# Altium schematic sheet Sheet_1_2022-03-27.schdoc
size 391 x 229 mm
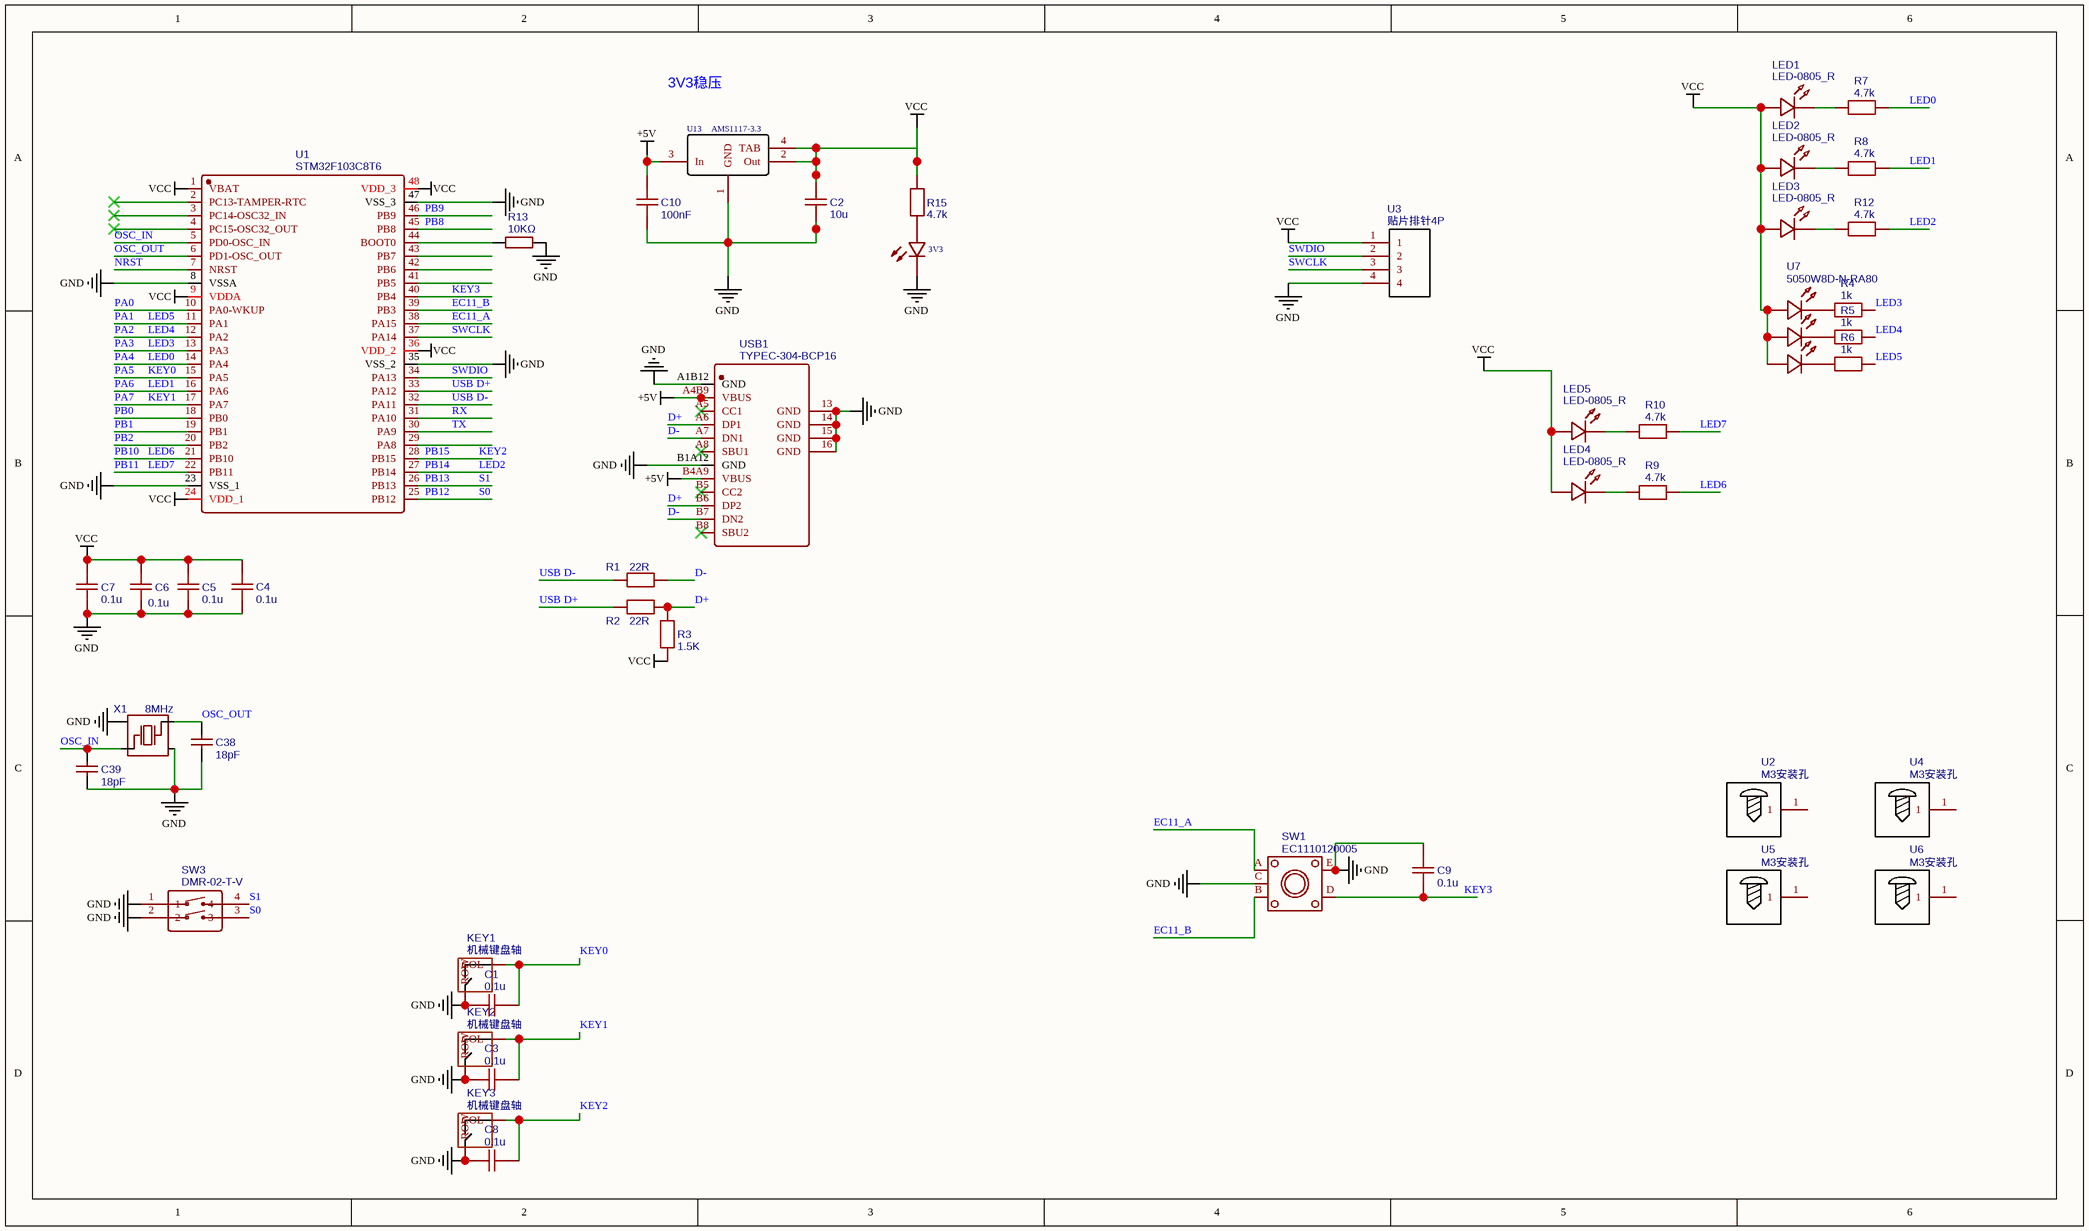
[diagram p0: Sheet_1_2022-03-27.schdoc]

## Parts
3V3  17-21/BHC-XL2M2TY/3T  [LED0805-RD]  (value not drawn)
C1  0.1u  [C0805]
C2  10u  [C0805]
C3  0.1u  [C0805]
C4  0.1u  [C0805]
C5  0.1u  [C0805]
C6  0.1u  [C0805]
C7  0.1u  [C0805]
C8  0.1u  [C0805]
C9  0.1u  [C0805]
C10  100nF  [C0805]
C38  18pF  [C0805]
C39  18pF  [C0805]
KEY1  机械键盘轴  [机械键盘轴]
KEY2  机械键盘轴  [机械键盘轴]
KEY3  机械键盘轴  [机械键盘轴]
LED1  LED-0805_R  [LED0805_RED]
LED2  LED-0805_R  [LED0805_RED]
LED3  LED-0805_R  [LED0805_RED]
LED4  LED-0805_R  [LED0805_RED]
LED5  LED-0805_R  [LED0805_RED]
R1  22R  [R0805]
R2  22R  [R0805]
R3  1.5K  [R0805]
R4  1k  [R0805]
R5  1k  [R0805]
R6  1k  [R0805]
R7  4.7k  [R0805]
R8  4.7k  [R0805]
R9  4.7k  [R0805]
R10  4.7k  [R0805]
R12  4.7k  [R0805]
R13  10KΩ  [R0805]
R15  4.7k  [R0805]
SW1  EC1110120005  [SW-TH_EC111XXXX]
SW3  DMR-02-T-V  [SW-SMD_DMR-02-T-V]
U1  STM32F103C8T6  [LQFP-48_L7.0-W7.0-P0.50-LS9.0-BL]
U2  M3安装孔  [洞3MM]
U3  贴片排针4P  [贴片排针4P]
U4  M3安装孔  [洞3MM]
U5  M3安装孔  [洞3MM]
U6  M3安装孔  [洞3MM]
U7  5050W8D-N-RA80  [LED-SMD_6P-L5.0-W5.0-5050W8D-N-RA80]
U13  AMS1117-3.3  [SOT-223_L6.5-W3.5-P2.30-LS7.0-BR]
USB1  TYPEC-304-BCP16  [USB-C-SMD_TYPEC-304-BCP16]
X1  8MHz  [OSC-SMD_4P-L3.2-W2.5-BL]

## Nets
+5V: C10.2 U13.3(In) USB1.A4B9(VBUS) USB1.B4A9(VBUS)
GND: 3V3.1(-) C1.2 C2.1 C3.1 C4.1 C5.1 C6.1 C7.1 C8.1 C9.1 C10.1 C38.1 C39.1 KEY1.ROW KEY2.ROW KEY3.ROW R13.1 SW1.C SW1.E SW3.1 SW3.2 U1.8(VSSA) U1.23(VSS_1) U1.35(VSS_2) U1.47(VSS_3) U3.4 U13.1(GND) USB1.13(GND) USB1.14(GND) USB1.15(GND) USB1.16(GND) USB1.A1B12(GND) USB1.B1A12(GND) X1.2 X1.4
VCC: C2.2 C4.2 C5.2 C6.2 C7.2 LED1.1 LED2.1 LED3.1 LED4.1 LED5.1 R3.1 R15.2 U1.1(VBAT) U1.9(VDDA) U1.24(VDD_1) U1.36(VDD_2) U1.48(VDD_3) U3.1 U7.4(A) U7.5(A) U7.6(A) U13.2(Out) U13.4(TAB)
D+: R2.2 R3.2 USB1.A6(DP1) USB1.B6(DP2)
D-: R1.2 USB1.A7(DN1) USB1.B7(DN2)
EC11_A: SW1.A U1.38(PA15)
EC11_B: SW1.B U1.39(PB3)
KEY0: C1.1 KEY1.COL U1.15(PA5)  [also labelled PA5]
KEY1: C3.2 KEY2.COL U1.17(PA7)  [also labelled PA7]
KEY2: C8.2 KEY3.COL U1.28(PB15)  [also labelled PB15]
KEY3: C9.2 SW1.D U1.40(PB4)
LED0: R7.2 U1.14(PA4)  [also labelled PA4]
LED1: R8.2 U1.16(PA6)  [also labelled PA6]
LED2: R12.2 U1.27(PB14)  [also labelled PB14]
LED3: R4.2 U1.13(PA3)  [also labelled PA3]
LED4: R5.2 U1.12(PA2)  [also labelled PA2]
LED5: R6.2 U1.11(PA1)  [also labelled PA1]
LED6: R9.2 U1.21(PB10)  [also labelled PB10]
LED7: R10.2 U1.22(PB11)  [also labelled PB11]
NRST: U1.7(NRST)
OSC_IN: C39.2 U1.5(PD0-OSC_IN) X1.1
OSC_OUT: C38.2 U1.6(PD1-OSC_OUT) X1.3
PA0: U1.10(PA0-WKUP)
PB0: U1.18(PB0)
PB1: U1.19(PB1)
PB2: U1.20(PB2)
PB8: U1.45(PB8)
PB9: U1.46(PB9)
PB12: SW3.3 U1.25(PB12)  [also labelled S0]
PB13: SW3.4 U1.26(PB13)  [also labelled S1]
RX: U1.31(PA10)
SWCLK: U1.37(PA14) U3.3
SWDIO: U1.34(PA13) U3.2
TX: U1.30(PA9)
USB D+: R2.1 U1.33(PA12)
USB D-: R1.1 U1.32(PA11)
Net3V3_2: 3V3.2(+) R15.1
NetLED1_2: LED1.2 R7.1
NetLED2_2: LED2.2 R8.1
NetLED3_2: LED3.2 R12.1
NetLED4_2: LED4.2 R9.1
NetLED5_2: LED5.2 R10.1
NetR4_1: R4.1 U7.3(K)
NetR5_1: R5.1 U7.2(K)
NetR6_1: R6.1 U7.1(K)
NetR13_2: R13.2 U1.44(BOOT0)

Not connected (* = marked no-connect by the designer): U1 2(PC13-TAMPER-RTC)* 3(PC14-OSC32_IN)* 4(PC15-OSC32_OUT)* 29(PA8) 41(PB5) 42(PB6) 43(PB7); U2 1; U4 1; U5 1; U6 1; USB1 A5(CC1)* A8(SBU1)* B5(CC2)* B8(SBU2)*

## Notes on the sheet
- 3V3稳压

## Library data of the parts
3V3 = 17-21/BHC-XL2M2TY/3T: BOM_Manufacturer: EVERLIGHT; SMT Type: Extend; BOM_Supplier: LCSC; BOM_Manufacturer Part: 17-21/BHC-XL2M2TY/3T; image: //image.lceda.cn/szlcsc/C72035.jpg; BOM_Supplier Part: C72035; BOM_LCSC Assembly: Yes; spicePre: L; spiceSymbolName: 17-21/BHC-XL2M2TY/3T
C1 C3-C9 = 0.1u: nameAlias: Value(F); Contributor: LCEDA_Lib; spicePre: C; spiceSymbolName: C_0805_US
C2 = 10u: nameAlias: Value(F); Contributor: LCEDA_Lib; spicePre: C; spiceSymbolName: C_0805_US
C10 = 100nF: nameAlias: Value(F); Contributor: LCEDA_Lib; spicePre: C; spiceSymbolName: C_0805_US
C38 C39 = 18pF: BOM_Manufacturer Part: CL10C180JB8NNNC; BOM_Manufacturer: SAMSUNG; nameAlias: Capacitance; BOM_Paste Type: base; BOM_Assembly Type: smtWeld; BOM_Supplier: LCSC; BOM_Supplier Part: C1647; spicePre: C; spiceSymbolName: CL10C180JB8NNNC
KEY1-KEY3 = 机械键盘轴: Contributor: Ptisak; spicePre: K; spiceSymbolName: 机械键盘轴
LED1-LED5 = LED-0805_R: BOM_Manufacturer: EVERLIGHT(台湾亿光); BOM_Manufacturer Part: 17-21SURC/S530-A3/TR8; Contributor: LCEDA_Lib; BOM_Supplier Part: C72037; spicePre: L; spiceSymbolName: LED-0805_R
R1 R2 = 22R: nameAlias: Value(Ω); Contributor: LCEDA_Lib; spicePre: R; spiceSymbolName: R_0805_EU
R3 = 1.5K: nameAlias: Value(Ω); Contributor: LCEDA_Lib; spicePre: R; spiceSymbolName: R_0805_EU
R4-R6 = 1k: nameAlias: Value(Ω); Contributor: LCEDA_Lib; spicePre: R; spiceSymbolName: R_0805_EU
R7-R10 R12 R15 = 4.7k: nameAlias: Value(Ω); Contributor: LCEDA_Lib; spicePre: R
  R7-R10 R12: spiceSymbolName: R_0805_EU
  R15: spiceSymbolName: R_0603_EU
R13 = 10KΩ: BOM_Manufacturer: UniOhm; BOM_Manufacturer Part: 0603WAF1002T5E; nameAlias: Resistance (Ohms); SMT Type: Basic; BOM_Paste Type: base; BOM_Assembly Type: smtWeld; BOM_Supplier: LCSC; BOM_LCSC Assembly: Yes; BOM_Supplier Part: C25804; spicePre: R; spiceSymbolName: 0603WAF1002T5E
SW1 = EC1110120005: BOM_Manufacturer: ALPS Electric; Contributor: LCSC; BOM_Supplier: LCSC; BOM_Supplier Part: C470788; BOM_Manufacturer Part: EC1110120005; BOM_JLCPCB Part Class: Extended Part; spicePre: S; spiceSymbolName: EC1110120005
SW3 = DMR-02-T-V: BOM_Manufacturer: DIP; Contributor: LCSC; BOM_Supplier: LCSC; BOM_Manufacturer Part: DMR-02-T-V; BOM_Supplier Part: C139554; BOM_JLCPCB Part Class: Extended Part; spicePre: S; spiceSymbolName: DMR-02-T-V
U1 = STM32F103C8T6: BOM_Manufacturer: STMicroelectronics; timeStamp: 1455028086; BOM_Supplier: LCSC; BOM_Manufacturer Part: STM32F103C8T6; BOM_Supplier Part: C8734; BOM_JLCPCB Part Class: Basic Part; spicePre: U; spiceSymbolName: STM32F103C8T6
U2 U4-U6 = M3安装孔: Contributor: Ptisak; spicePre: U; spiceSymbolName: M3安装孔
U3 = 贴片排针4P: Contributor: Ptisak; spicePre: U; spiceSymbolName: 贴片排针4P
U7 = 5050W8D-N-RA80: BOM_Manufacturer: null; Contributor: LCSC; BOM_Supplier: LCSC; BOM_Supplier Part: C2842550; BOM_Manufacturer Part: 5050W8D-N-Ra80; BOM_JLCPCB Part Class: Extended Part; spicePre: U; spiceSymbolName: 5050W8D-N-RA80
U13 = AMS1117-3.3: BOM_Manufacturer: AMS; sourceId: HltLFyQwq; SMT Type: Basic; timeStamp: 1466676067; BOM_Supplier: LCSC; BOM_Manufacturer Part: AMS1117-3.3; BOM_LCSC Assembly: Yes; image: //image.lceda.cn/szlcsc/C6187.jpg; BOM_Supplier Part: C6187; spicePre: U; spiceSymbolName: AMS1117-5.0
USB1 = TYPEC-304-BCP16: BOM_Manufacturer: XUNPU; Contributor: LCSC; BOM_Supplier: LCSC; BOM_Supplier Part: C720629; BOM_Manufacturer Part: TYPEC-304-BCP16; BOM_JLCPCB Part Class: Extended Part; spicePre: U; spiceSymbolName: TYPEC-304-BCP16
X1 = 8MHz: BOM_Manufacturer: Zhejiang Abel Elec; BOM_Manufacturer Part: TAXM8M4RDBCCT2T; nameAlias: Frequency; Contributor: LCSC; BOM_Paste Type: expand; BOM_Assembly Type: smtWeld; BOM_Supplier: LCSC; BOM_Supplier Part: C400090; spicePre: X; spiceSymbolName: TAXM8M4RDBCCT2T